# Altium schematic sheet PAGE13.SchDoc
size 246 x 182 mm
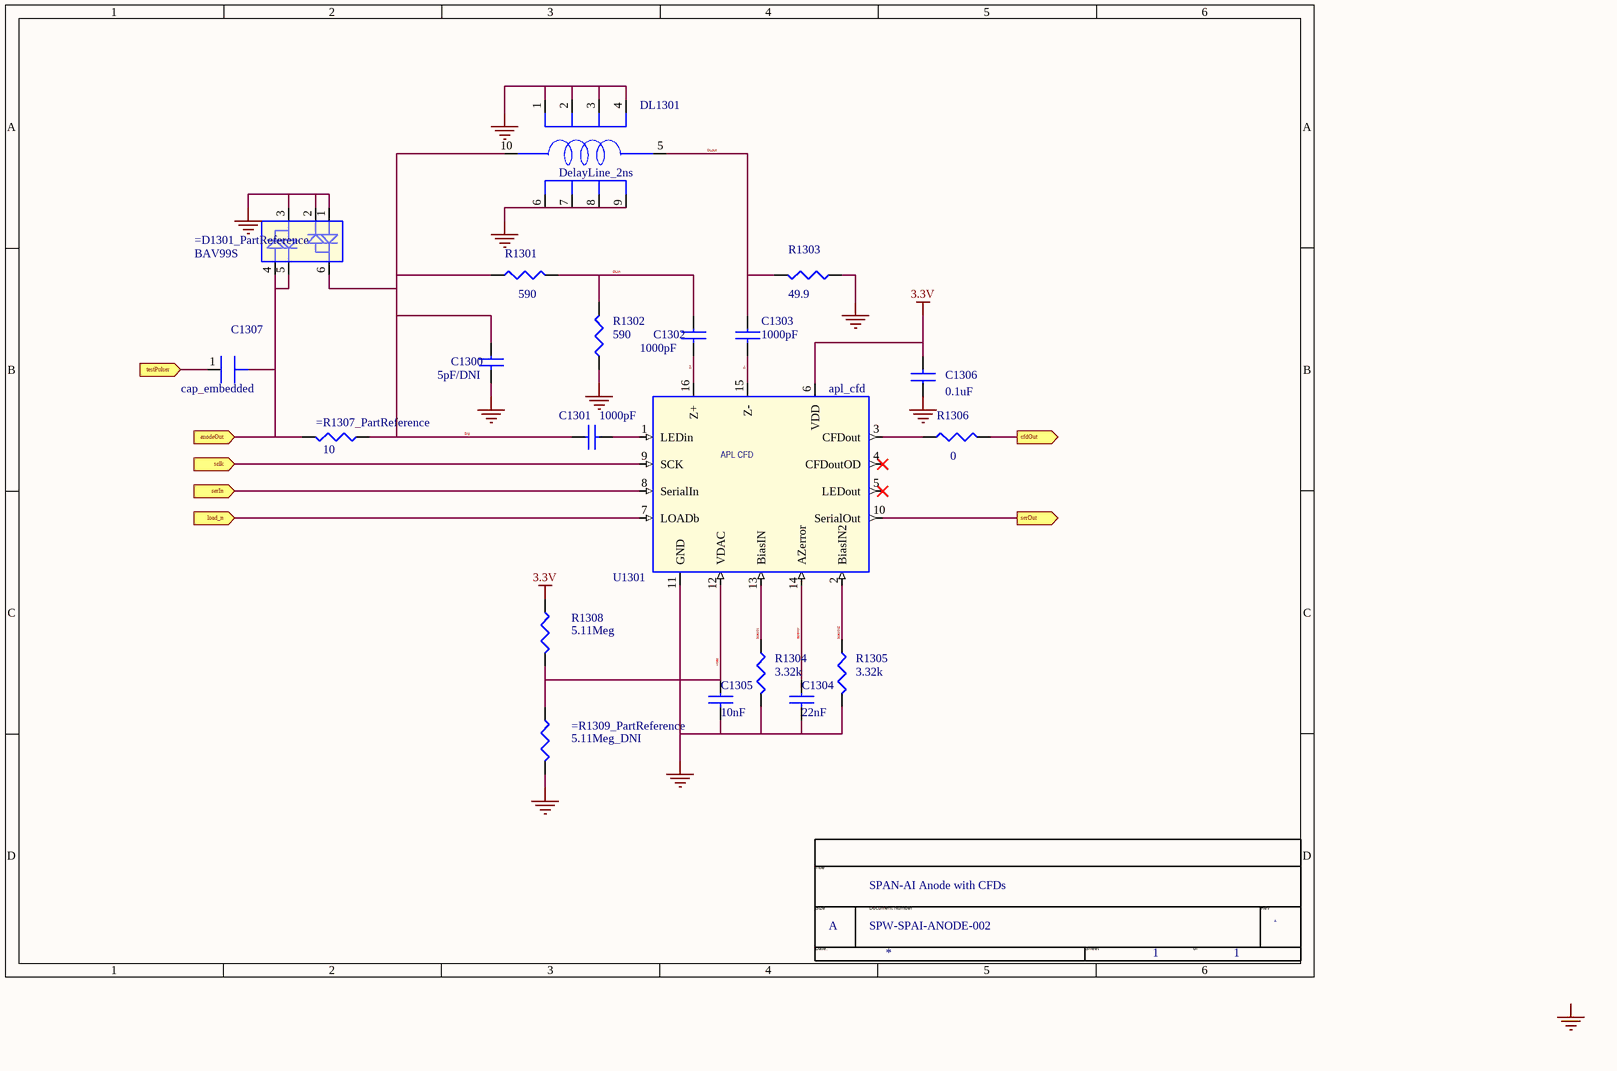
[diagram p0: PAGE13.SchDoc]

## Parts
*  Page Count: 1  Page Size: A  Title: SPAN-AI Anode with CFDs  Doc: SPW-SPAI-ANODE-002  (hidden comment: TitleBlock0)  (graphical)
=D1301_PartReference  BAV99S  [sot23]
=R1307_PartReference  10  [0402]
=R1309_PartReference  5.11Meg_DNI  [0402]
C1300  5pF/DNI  [0402]
C1301  1000pF  [0402]
C1302  1000pF  [0402]
C1303  1000pF  [0402]
C1304  22nF  [0603]
C1305  10nF  [0603]
C1306  0.1uF  [0805]
C1307  cap_embedded  [cap_emb]
DL1301  DelayLine_2ns  [CDM10]
R1301  590  [0402]
R1302  590  [0402]
R1303  49.9  [0402]
R1304  3.32k  [0402]
R1305  3.32k  [0402]
R1306  0  [0402]
R1308  5.11Meg  [0402]
U1301  apl_cfd  [lcc16]

## Ports
anodeOut (in), cfdOut (out), load_n (in), sclk (in), serIn (in), serOut (out), testPulser (in)

## Nets
3.3V: C1306.2 R1308.1 U1301.6(VDD)
GND: =D1301_PartReference.1 =D1301_PartReference.2 =D1301_PartReference.3 =R1309_PartReference.2 C1300.2 C1304.2 C1305.2 C1306.1 DL1301.1(GND1) DL1301.2(GND2) DL1301.3(GND3) DL1301.4(GND4) DL1301.6(GND5) DL1301.7(GND6) DL1301.8(GND7) DL1301.9(GND8) R1302.1 R1303.1 R1304.2 R1305.2 U1301.11(GND)
anodeOut: =D1301_PartReference.4 =D1301_PartReference.5 =R1307_PartReference.2 ; port anodeOut
azerror: C1304.1 U1301.14(AZerror)
biasIN: R1304.1 U1301.13(BiasIN)
biasIN2: R1305.1 U1301.2(BiasIN2)
cfdOut: R1306.2 ; port cfdOut
DLin: C1302.1 R1301.2 R1302.2
DLout: C1303.1 DL1301.5(OUT) R1303.2
load_n: U1301.7(LOADb) ; port load_n
sclk: U1301.9(SCK) ; port sclk
serIn: U1301.8(SerialIn) ; port serIn
serOut: U1301.10(SerialOut) ; port serOut
Sig: =D1301_PartReference.6 =R1307_PartReference.1 C1300.1 C1301.1 DL1301.10(IN) R1301.1
testPulser: C1307.1 ; port testPulser
vdac: =R1309_PartReference.1 C1305.1 R1308.2 U1301.12(VDAC)
z+: C1302.2 U1301.16(Z+)
z-: C1303.2 U1301.15(Z-)
NetC1301_2: C1301.2 U1301.1(LEDin)
NetR1306_1: R1306.1 U1301.3(CFDout)

Not connected (* = marked no-connect by the designer): U1301 4(CFDoutOD)* 5(LEDout)*

## Notes on the sheet
- Labels drawn without touching a wire or pin: GND
- (in symbol apl_cfd_1) APL CFD
- (in symbol TitleBlock0) Title; Size; Document Number; Rev; Date:; Sheet; of

## Library data of the parts
=D1301_PartReference = dual_diode_0: PartNumber: BAV99S; PCB Footprint: BAV99S
=R1307_PartReference = R_Dup1: PartNumber: M55342H11B10D0R; PCB Footprint: 0402
=R1309_PartReference R1308 = R: Pin Numbers Visible: True; Pin Names Visible: False; EDIForiginalOrigin: (pt 0 0); EDIFviewName: NORMAL; PCB Footprint: 0402
C1300 = CAP NP_Dup2: PartNumber: SR0402NPO5R0B3; PCB Footprint: 0402
C1301-C1303 = CAP NP_Dup2: PartNumber: SR0402NPO102B3; PCB Footprint: 0402
C1304 = CAP NP_Dup2: PartNumber: SR0603X7R223K2NT95#M123; PCB Footprint: 0603
C1305 = CAP NP_Dup2: PartNumber: SR0603X7R103K2NT95#M123; PCB Footprint: 0603
C1306 = CAP NP_Dup2: PartNumber: SR0805X7R104K2NT95#M123; PCB Footprint: 0805
DL1301 = DelayLine_1: PartNumber: CDM2005; PCB Footprint: CDM2005
R1301 R1302 = R_Dup1: PartNumber: M55342H11B590DR; PCB Footprint: 0402
R1303 = R_Dup1: PartNumber: M55342H11B49D9R; PCB Footprint: 0402
R1304 R1305 = R_Dup1: PartNumber: M55342H11B3E32R; PCB Footprint: 0402
R1306 = R_Dup1: PCB Footprint: 0402
U1301 = apl_cfd_1: PCB Footprint: apl_cfd
* = TitleBlock0: Page Number: 1; RevCode: A; Page Create Date: March  8, 1995; Page Modify Date: *
C1307 = cap_embedded: PCB Footprint: cap_emb